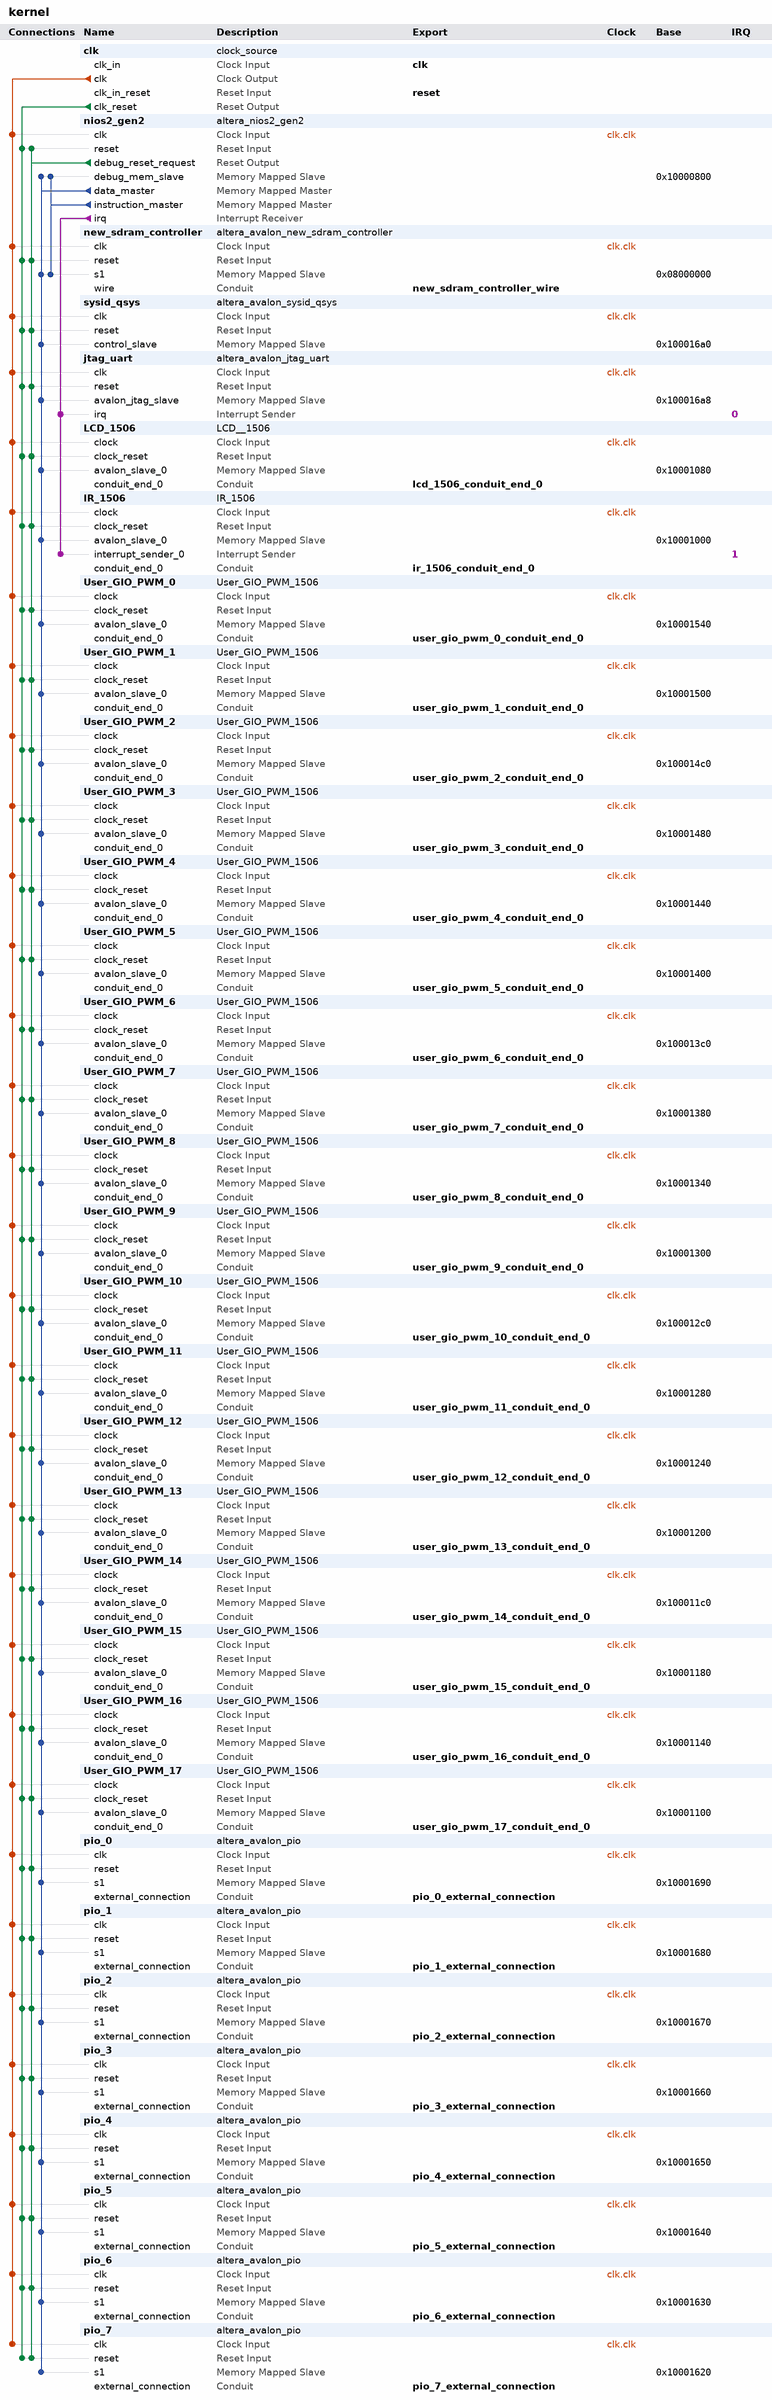
[diagram p0: system contents]
# Platform Designer (Qsys) system kernel, Cyclone IV E EP4CE115F29C7
# Parameters at their usual value, and those the tool derives, are not listed.
package require -exact qsys 15.0
create_system kernel
set_project_property DEVICE_FAMILY {Cyclone IV E}
set_project_property DEVICE EP4CE115F29C7

add_instance clk clock_source 15.0
set_instance_parameter_value clk clockFrequency 100000000

add_instance nios2_gen2 altera_nios2_gen2 15.0
set_instance_parameter_value nios2_gen2 dcache_size 0
set_instance_parameter_value nios2_gen2 debug_datatrigger 2
set_instance_parameter_value nios2_gen2 debug_hwbreakpoint 2
set_instance_parameter_value nios2_gen2 debug_traceType instruction_and_data_trace
set_instance_parameter_value nios2_gen2 exceptionSlave new_sdram_controller.s1
set_instance_parameter_value nios2_gen2 icache_size 4096
set_instance_parameter_value nios2_gen2 impl Fast
set_instance_parameter_value nios2_gen2 resetSlave new_sdram_controller.s1

add_instance new_sdram_controller altera_avalon_new_sdram_controller 15.0
set_instance_parameter_value new_sdram_controller TAC 5.5
set_instance_parameter_value new_sdram_controller TRCD 20.0
set_instance_parameter_value new_sdram_controller TRP 20.0
set_instance_parameter_value new_sdram_controller casLatency 3
set_instance_parameter_value new_sdram_controller columnWidth 10
set_instance_parameter_value new_sdram_controller dataWidth 32
set_instance_parameter_value new_sdram_controller generateSimulationModel false
set_instance_parameter_value new_sdram_controller model single_Micron_MT48LC4M32B2_7_chip
set_instance_parameter_value new_sdram_controller numberOfBanks 4
set_instance_parameter_value new_sdram_controller numberOfChipSelects 1
set_instance_parameter_value new_sdram_controller powerUpDelay 100.0
set_instance_parameter_value new_sdram_controller refreshPeriod 15.625
set_instance_parameter_value new_sdram_controller rowWidth 13

add_instance sysid_qsys altera_avalon_sysid_qsys 15.0
set_instance_parameter_value sysid_qsys id 2

add_instance jtag_uart altera_avalon_jtag_uart 15.0
set_instance_parameter_value jtag_uart simInteractiveOptions NO_INTERACTIVE_WINDOWS

add_instance LCD_1506 LCD__1506 1.0

add_instance IR_1506 IR_1506 1.0

add_instance User_GIO_PWM_0 User_GIO_PWM_1506 1.0

add_instance User_GIO_PWM_1 User_GIO_PWM_1506 1.0

add_instance User_GIO_PWM_2 User_GIO_PWM_1506 1.0

add_instance User_GIO_PWM_3 User_GIO_PWM_1506 1.0

add_instance User_GIO_PWM_4 User_GIO_PWM_1506 1.0

add_instance User_GIO_PWM_5 User_GIO_PWM_1506 1.0

add_instance User_GIO_PWM_6 User_GIO_PWM_1506 1.0

add_instance User_GIO_PWM_7 User_GIO_PWM_1506 1.0

add_instance User_GIO_PWM_8 User_GIO_PWM_1506 1.0

add_instance User_GIO_PWM_9 User_GIO_PWM_1506 1.0

add_instance User_GIO_PWM_10 User_GIO_PWM_1506 1.0

add_instance User_GIO_PWM_11 User_GIO_PWM_1506 1.0

add_instance User_GIO_PWM_12 User_GIO_PWM_1506 1.0

add_instance User_GIO_PWM_13 User_GIO_PWM_1506 1.0

add_instance User_GIO_PWM_14 User_GIO_PWM_1506 1.0

add_instance User_GIO_PWM_15 User_GIO_PWM_1506 1.0

add_instance User_GIO_PWM_16 User_GIO_PWM_1506 1.0

add_instance User_GIO_PWM_17 User_GIO_PWM_1506 1.0

add_instance pio_0 altera_avalon_pio 15.0
set_instance_parameter_value pio_0 direction Output
set_instance_parameter_value pio_0 width 1

add_instance pio_1 altera_avalon_pio 15.0
set_instance_parameter_value pio_1 direction Output
set_instance_parameter_value pio_1 width 1

add_instance pio_2 altera_avalon_pio 15.0
set_instance_parameter_value pio_2 direction Output
set_instance_parameter_value pio_2 width 1

add_instance pio_3 altera_avalon_pio 15.0
set_instance_parameter_value pio_3 direction Output
set_instance_parameter_value pio_3 width 1

add_instance pio_4 altera_avalon_pio 15.0
set_instance_parameter_value pio_4 direction Output
set_instance_parameter_value pio_4 width 1

add_instance pio_5 altera_avalon_pio 15.0
set_instance_parameter_value pio_5 direction Output
set_instance_parameter_value pio_5 width 1

add_instance pio_6 altera_avalon_pio 15.0
set_instance_parameter_value pio_6 direction Output
set_instance_parameter_value pio_6 width 1

add_instance pio_7 altera_avalon_pio 15.0
set_instance_parameter_value pio_7 direction Output
set_instance_parameter_value pio_7 width 1

# connections
add_connection clk.clk IR_1506.clock clock
add_connection clk.clk jtag_uart.clk clock
add_connection clk.clk LCD_1506.clock clock
add_connection clk.clk new_sdram_controller.clk clock
add_connection clk.clk nios2_gen2.clk clock
add_connection clk.clk pio_0.clk clock
add_connection clk.clk pio_1.clk clock
add_connection clk.clk pio_2.clk clock
add_connection clk.clk pio_3.clk clock
add_connection clk.clk pio_4.clk clock
add_connection clk.clk pio_5.clk clock
add_connection clk.clk pio_6.clk clock
add_connection clk.clk pio_7.clk clock
add_connection clk.clk sysid_qsys.clk clock
add_connection clk.clk User_GIO_PWM_0.clock clock
add_connection clk.clk User_GIO_PWM_1.clock clock
add_connection clk.clk User_GIO_PWM_2.clock clock
add_connection clk.clk User_GIO_PWM_3.clock clock
add_connection clk.clk User_GIO_PWM_4.clock clock
add_connection clk.clk User_GIO_PWM_5.clock clock
add_connection clk.clk User_GIO_PWM_6.clock clock
add_connection clk.clk User_GIO_PWM_7.clock clock
add_connection clk.clk User_GIO_PWM_8.clock clock
add_connection clk.clk User_GIO_PWM_9.clock clock
add_connection clk.clk User_GIO_PWM_10.clock clock
add_connection clk.clk User_GIO_PWM_11.clock clock
add_connection clk.clk User_GIO_PWM_12.clock clock
add_connection clk.clk User_GIO_PWM_13.clock clock
add_connection clk.clk User_GIO_PWM_14.clock clock
add_connection clk.clk User_GIO_PWM_15.clock clock
add_connection clk.clk User_GIO_PWM_16.clock clock
add_connection clk.clk User_GIO_PWM_17.clock clock
add_connection clk.clk_reset IR_1506.clock_reset reset
add_connection clk.clk_reset jtag_uart.reset reset
add_connection clk.clk_reset LCD_1506.clock_reset reset
add_connection clk.clk_reset new_sdram_controller.reset reset
add_connection clk.clk_reset nios2_gen2.reset reset
add_connection clk.clk_reset pio_0.reset reset
add_connection clk.clk_reset pio_1.reset reset
add_connection clk.clk_reset pio_2.reset reset
add_connection clk.clk_reset pio_3.reset reset
add_connection clk.clk_reset pio_4.reset reset
add_connection clk.clk_reset pio_5.reset reset
add_connection clk.clk_reset pio_6.reset reset
add_connection clk.clk_reset pio_7.reset reset
add_connection clk.clk_reset sysid_qsys.reset reset
add_connection clk.clk_reset User_GIO_PWM_0.clock_reset reset
add_connection clk.clk_reset User_GIO_PWM_1.clock_reset reset
add_connection clk.clk_reset User_GIO_PWM_2.clock_reset reset
add_connection clk.clk_reset User_GIO_PWM_3.clock_reset reset
add_connection clk.clk_reset User_GIO_PWM_4.clock_reset reset
add_connection clk.clk_reset User_GIO_PWM_5.clock_reset reset
add_connection clk.clk_reset User_GIO_PWM_6.clock_reset reset
add_connection clk.clk_reset User_GIO_PWM_7.clock_reset reset
add_connection clk.clk_reset User_GIO_PWM_8.clock_reset reset
add_connection clk.clk_reset User_GIO_PWM_9.clock_reset reset
add_connection clk.clk_reset User_GIO_PWM_10.clock_reset reset
add_connection clk.clk_reset User_GIO_PWM_11.clock_reset reset
add_connection clk.clk_reset User_GIO_PWM_12.clock_reset reset
add_connection clk.clk_reset User_GIO_PWM_13.clock_reset reset
add_connection clk.clk_reset User_GIO_PWM_14.clock_reset reset
add_connection clk.clk_reset User_GIO_PWM_15.clock_reset reset
add_connection clk.clk_reset User_GIO_PWM_16.clock_reset reset
add_connection clk.clk_reset User_GIO_PWM_17.clock_reset reset
add_connection nios2_gen2.debug_reset_request IR_1506.clock_reset reset
add_connection nios2_gen2.debug_reset_request jtag_uart.reset reset
add_connection nios2_gen2.debug_reset_request LCD_1506.clock_reset reset
add_connection nios2_gen2.debug_reset_request new_sdram_controller.reset reset
add_connection nios2_gen2.debug_reset_request nios2_gen2.reset reset
add_connection nios2_gen2.debug_reset_request pio_0.reset reset
add_connection nios2_gen2.debug_reset_request pio_1.reset reset
add_connection nios2_gen2.debug_reset_request pio_2.reset reset
add_connection nios2_gen2.debug_reset_request pio_3.reset reset
add_connection nios2_gen2.debug_reset_request pio_4.reset reset
add_connection nios2_gen2.debug_reset_request pio_5.reset reset
add_connection nios2_gen2.debug_reset_request pio_6.reset reset
add_connection nios2_gen2.debug_reset_request pio_7.reset reset
add_connection nios2_gen2.debug_reset_request sysid_qsys.reset reset
add_connection nios2_gen2.debug_reset_request User_GIO_PWM_0.clock_reset reset
add_connection nios2_gen2.debug_reset_request User_GIO_PWM_1.clock_reset reset
add_connection nios2_gen2.debug_reset_request User_GIO_PWM_2.clock_reset reset
add_connection nios2_gen2.debug_reset_request User_GIO_PWM_3.clock_reset reset
add_connection nios2_gen2.debug_reset_request User_GIO_PWM_4.clock_reset reset
add_connection nios2_gen2.debug_reset_request User_GIO_PWM_5.clock_reset reset
add_connection nios2_gen2.debug_reset_request User_GIO_PWM_6.clock_reset reset
add_connection nios2_gen2.debug_reset_request User_GIO_PWM_7.clock_reset reset
add_connection nios2_gen2.debug_reset_request User_GIO_PWM_8.clock_reset reset
add_connection nios2_gen2.debug_reset_request User_GIO_PWM_9.clock_reset reset
add_connection nios2_gen2.debug_reset_request User_GIO_PWM_10.clock_reset reset
add_connection nios2_gen2.debug_reset_request User_GIO_PWM_11.clock_reset reset
add_connection nios2_gen2.debug_reset_request User_GIO_PWM_12.clock_reset reset
add_connection nios2_gen2.debug_reset_request User_GIO_PWM_13.clock_reset reset
add_connection nios2_gen2.debug_reset_request User_GIO_PWM_14.clock_reset reset
add_connection nios2_gen2.debug_reset_request User_GIO_PWM_15.clock_reset reset
add_connection nios2_gen2.debug_reset_request User_GIO_PWM_16.clock_reset reset
add_connection nios2_gen2.debug_reset_request User_GIO_PWM_17.clock_reset reset
add_connection nios2_gen2.data_master IR_1506.avalon_slave_0 avalon
set_connection_parameter_value nios2_gen2.data_master/IR_1506.avalon_slave_0 baseAddress 0x10001000
add_connection nios2_gen2.data_master jtag_uart.avalon_jtag_slave avalon
set_connection_parameter_value nios2_gen2.data_master/jtag_uart.avalon_jtag_slave baseAddress 0x100016a8
add_connection nios2_gen2.data_master LCD_1506.avalon_slave_0 avalon
set_connection_parameter_value nios2_gen2.data_master/LCD_1506.avalon_slave_0 baseAddress 0x10001080
add_connection nios2_gen2.data_master new_sdram_controller.s1 avalon
set_connection_parameter_value nios2_gen2.data_master/new_sdram_controller.s1 baseAddress 0x08000000
add_connection nios2_gen2.data_master nios2_gen2.debug_mem_slave avalon
set_connection_parameter_value nios2_gen2.data_master/nios2_gen2.debug_mem_slave baseAddress 0x10000800
add_connection nios2_gen2.data_master pio_0.s1 avalon
set_connection_parameter_value nios2_gen2.data_master/pio_0.s1 baseAddress 0x10001690
add_connection nios2_gen2.data_master pio_1.s1 avalon
set_connection_parameter_value nios2_gen2.data_master/pio_1.s1 baseAddress 0x10001680
add_connection nios2_gen2.data_master pio_2.s1 avalon
set_connection_parameter_value nios2_gen2.data_master/pio_2.s1 baseAddress 0x10001670
add_connection nios2_gen2.data_master pio_3.s1 avalon
set_connection_parameter_value nios2_gen2.data_master/pio_3.s1 baseAddress 0x10001660
add_connection nios2_gen2.data_master pio_4.s1 avalon
set_connection_parameter_value nios2_gen2.data_master/pio_4.s1 baseAddress 0x10001650
add_connection nios2_gen2.data_master pio_5.s1 avalon
set_connection_parameter_value nios2_gen2.data_master/pio_5.s1 baseAddress 0x10001640
add_connection nios2_gen2.data_master pio_6.s1 avalon
set_connection_parameter_value nios2_gen2.data_master/pio_6.s1 baseAddress 0x10001630
add_connection nios2_gen2.data_master pio_7.s1 avalon
set_connection_parameter_value nios2_gen2.data_master/pio_7.s1 baseAddress 0x10001620
add_connection nios2_gen2.data_master sysid_qsys.control_slave avalon
set_connection_parameter_value nios2_gen2.data_master/sysid_qsys.control_slave baseAddress 0x100016a0
add_connection nios2_gen2.data_master User_GIO_PWM_0.avalon_slave_0 avalon
set_connection_parameter_value nios2_gen2.data_master/User_GIO_PWM_0.avalon_slave_0 baseAddress 0x10001540
add_connection nios2_gen2.data_master User_GIO_PWM_1.avalon_slave_0 avalon
set_connection_parameter_value nios2_gen2.data_master/User_GIO_PWM_1.avalon_slave_0 baseAddress 0x10001500
add_connection nios2_gen2.data_master User_GIO_PWM_2.avalon_slave_0 avalon
set_connection_parameter_value nios2_gen2.data_master/User_GIO_PWM_2.avalon_slave_0 baseAddress 0x100014c0
add_connection nios2_gen2.data_master User_GIO_PWM_3.avalon_slave_0 avalon
set_connection_parameter_value nios2_gen2.data_master/User_GIO_PWM_3.avalon_slave_0 baseAddress 0x10001480
add_connection nios2_gen2.data_master User_GIO_PWM_4.avalon_slave_0 avalon
set_connection_parameter_value nios2_gen2.data_master/User_GIO_PWM_4.avalon_slave_0 baseAddress 0x10001440
add_connection nios2_gen2.data_master User_GIO_PWM_5.avalon_slave_0 avalon
set_connection_parameter_value nios2_gen2.data_master/User_GIO_PWM_5.avalon_slave_0 baseAddress 0x10001400
add_connection nios2_gen2.data_master User_GIO_PWM_6.avalon_slave_0 avalon
set_connection_parameter_value nios2_gen2.data_master/User_GIO_PWM_6.avalon_slave_0 baseAddress 0x100013c0
add_connection nios2_gen2.data_master User_GIO_PWM_7.avalon_slave_0 avalon
set_connection_parameter_value nios2_gen2.data_master/User_GIO_PWM_7.avalon_slave_0 baseAddress 0x10001380
add_connection nios2_gen2.data_master User_GIO_PWM_8.avalon_slave_0 avalon
set_connection_parameter_value nios2_gen2.data_master/User_GIO_PWM_8.avalon_slave_0 baseAddress 0x10001340
add_connection nios2_gen2.data_master User_GIO_PWM_9.avalon_slave_0 avalon
set_connection_parameter_value nios2_gen2.data_master/User_GIO_PWM_9.avalon_slave_0 baseAddress 0x10001300
add_connection nios2_gen2.data_master User_GIO_PWM_10.avalon_slave_0 avalon
set_connection_parameter_value nios2_gen2.data_master/User_GIO_PWM_10.avalon_slave_0 baseAddress 0x100012c0
add_connection nios2_gen2.data_master User_GIO_PWM_11.avalon_slave_0 avalon
set_connection_parameter_value nios2_gen2.data_master/User_GIO_PWM_11.avalon_slave_0 baseAddress 0x10001280
add_connection nios2_gen2.data_master User_GIO_PWM_12.avalon_slave_0 avalon
set_connection_parameter_value nios2_gen2.data_master/User_GIO_PWM_12.avalon_slave_0 baseAddress 0x10001240
add_connection nios2_gen2.data_master User_GIO_PWM_13.avalon_slave_0 avalon
set_connection_parameter_value nios2_gen2.data_master/User_GIO_PWM_13.avalon_slave_0 baseAddress 0x10001200
add_connection nios2_gen2.data_master User_GIO_PWM_14.avalon_slave_0 avalon
set_connection_parameter_value nios2_gen2.data_master/User_GIO_PWM_14.avalon_slave_0 baseAddress 0x100011c0
add_connection nios2_gen2.data_master User_GIO_PWM_15.avalon_slave_0 avalon
set_connection_parameter_value nios2_gen2.data_master/User_GIO_PWM_15.avalon_slave_0 baseAddress 0x10001180
add_connection nios2_gen2.data_master User_GIO_PWM_16.avalon_slave_0 avalon
set_connection_parameter_value nios2_gen2.data_master/User_GIO_PWM_16.avalon_slave_0 baseAddress 0x10001140
add_connection nios2_gen2.data_master User_GIO_PWM_17.avalon_slave_0 avalon
set_connection_parameter_value nios2_gen2.data_master/User_GIO_PWM_17.avalon_slave_0 baseAddress 0x10001100
add_connection nios2_gen2.instruction_master new_sdram_controller.s1 avalon
set_connection_parameter_value nios2_gen2.instruction_master/new_sdram_controller.s1 baseAddress 0x08000000
add_connection nios2_gen2.instruction_master nios2_gen2.debug_mem_slave avalon
set_connection_parameter_value nios2_gen2.instruction_master/nios2_gen2.debug_mem_slave baseAddress 0x10000800
add_connection nios2_gen2.irq IR_1506.interrupt_sender_0 interrupt
set_connection_parameter_value nios2_gen2.irq/IR_1506.interrupt_sender_0 irqNumber 1
add_connection nios2_gen2.irq jtag_uart.irq interrupt
set_connection_parameter_value nios2_gen2.irq/jtag_uart.irq irqNumber 0

# exported interfaces
add_interface clk clock sink
set_interface_property clk EXPORT_OF clk.clk_in
add_interface ir_1506_conduit_end_0 conduit end
set_interface_property ir_1506_conduit_end_0 EXPORT_OF IR_1506.conduit_end_0
add_interface lcd_1506_conduit_end_0 conduit end
set_interface_property lcd_1506_conduit_end_0 EXPORT_OF LCD_1506.conduit_end_0
add_interface new_sdram_controller_wire conduit end
set_interface_property new_sdram_controller_wire EXPORT_OF new_sdram_controller.wire
add_interface pio_0_external_connection conduit end
set_interface_property pio_0_external_connection EXPORT_OF pio_0.external_connection
add_interface pio_1_external_connection conduit end
set_interface_property pio_1_external_connection EXPORT_OF pio_1.external_connection
add_interface pio_2_external_connection conduit end
set_interface_property pio_2_external_connection EXPORT_OF pio_2.external_connection
add_interface pio_3_external_connection conduit end
set_interface_property pio_3_external_connection EXPORT_OF pio_3.external_connection
add_interface pio_4_external_connection conduit end
set_interface_property pio_4_external_connection EXPORT_OF pio_4.external_connection
add_interface pio_5_external_connection conduit end
set_interface_property pio_5_external_connection EXPORT_OF pio_5.external_connection
add_interface pio_6_external_connection conduit end
set_interface_property pio_6_external_connection EXPORT_OF pio_6.external_connection
add_interface pio_7_external_connection conduit end
set_interface_property pio_7_external_connection EXPORT_OF pio_7.external_connection
add_interface reset reset sink
set_interface_property reset EXPORT_OF clk.clk_in_reset
add_interface user_gio_pwm_0_conduit_end_0 conduit end
set_interface_property user_gio_pwm_0_conduit_end_0 EXPORT_OF User_GIO_PWM_0.conduit_end_0
add_interface user_gio_pwm_10_conduit_end_0 conduit end
set_interface_property user_gio_pwm_10_conduit_end_0 EXPORT_OF User_GIO_PWM_10.conduit_end_0
add_interface user_gio_pwm_11_conduit_end_0 conduit end
set_interface_property user_gio_pwm_11_conduit_end_0 EXPORT_OF User_GIO_PWM_11.conduit_end_0
add_interface user_gio_pwm_12_conduit_end_0 conduit end
set_interface_property user_gio_pwm_12_conduit_end_0 EXPORT_OF User_GIO_PWM_12.conduit_end_0
add_interface user_gio_pwm_13_conduit_end_0 conduit end
set_interface_property user_gio_pwm_13_conduit_end_0 EXPORT_OF User_GIO_PWM_13.conduit_end_0
add_interface user_gio_pwm_14_conduit_end_0 conduit end
set_interface_property user_gio_pwm_14_conduit_end_0 EXPORT_OF User_GIO_PWM_14.conduit_end_0
add_interface user_gio_pwm_15_conduit_end_0 conduit end
set_interface_property user_gio_pwm_15_conduit_end_0 EXPORT_OF User_GIO_PWM_15.conduit_end_0
add_interface user_gio_pwm_16_conduit_end_0 conduit end
set_interface_property user_gio_pwm_16_conduit_end_0 EXPORT_OF User_GIO_PWM_16.conduit_end_0
add_interface user_gio_pwm_17_conduit_end_0 conduit end
set_interface_property user_gio_pwm_17_conduit_end_0 EXPORT_OF User_GIO_PWM_17.conduit_end_0
add_interface user_gio_pwm_1_conduit_end_0 conduit end
set_interface_property user_gio_pwm_1_conduit_end_0 EXPORT_OF User_GIO_PWM_1.conduit_end_0
add_interface user_gio_pwm_2_conduit_end_0 conduit end
set_interface_property user_gio_pwm_2_conduit_end_0 EXPORT_OF User_GIO_PWM_2.conduit_end_0
add_interface user_gio_pwm_3_conduit_end_0 conduit end
set_interface_property user_gio_pwm_3_conduit_end_0 EXPORT_OF User_GIO_PWM_3.conduit_end_0
add_interface user_gio_pwm_4_conduit_end_0 conduit end
set_interface_property user_gio_pwm_4_conduit_end_0 EXPORT_OF User_GIO_PWM_4.conduit_end_0
add_interface user_gio_pwm_5_conduit_end_0 conduit end
set_interface_property user_gio_pwm_5_conduit_end_0 EXPORT_OF User_GIO_PWM_5.conduit_end_0
add_interface user_gio_pwm_6_conduit_end_0 conduit end
set_interface_property user_gio_pwm_6_conduit_end_0 EXPORT_OF User_GIO_PWM_6.conduit_end_0
add_interface user_gio_pwm_7_conduit_end_0 conduit end
set_interface_property user_gio_pwm_7_conduit_end_0 EXPORT_OF User_GIO_PWM_7.conduit_end_0
add_interface user_gio_pwm_8_conduit_end_0 conduit end
set_interface_property user_gio_pwm_8_conduit_end_0 EXPORT_OF User_GIO_PWM_8.conduit_end_0
add_interface user_gio_pwm_9_conduit_end_0 conduit end
set_interface_property user_gio_pwm_9_conduit_end_0 EXPORT_OF User_GIO_PWM_9.conduit_end_0

set_interconnect_requirement {$system} qsys_mm.clockCrossingAdapter HANDSHAKE
set_interconnect_requirement {$system} qsys_mm.enableEccProtection FALSE
set_interconnect_requirement {$system} qsys_mm.insertDefaultSlave FALSE
set_interconnect_requirement {$system} qsys_mm.maxAdditionalLatency 1

save_system kernel.qsys
